# Altium schematic sheet WifiNode_Cpu0_R00.SchDoc: WifiNode_Cpu0_R00
size A4; Author: Sfara, Gonzalo Agustín; CompanyName: Introducción al Diseño de Circuitos Impresos; Organization: UTN FRBA; Revision: 00; SheetNumber: 3; SheetTotal: 5
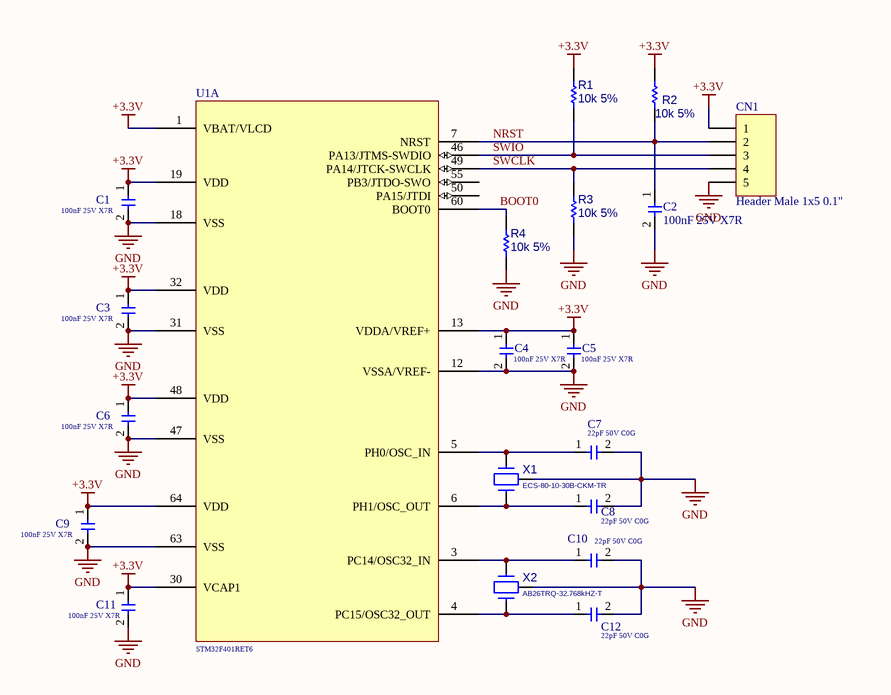
[diagram p0: WifiNode_Cpu0_R00.SchDoc]

## Parts
C1  100nF 25V X7R  [C_0805]
C2  100nF 25V X7R  [C_0805]
C3  100nF 25V X7R  [C_0805]
C4  100nF 25V X7R  [C_0805]
C5  100nF 25V X7R  [C_0805]
C6  100nF 25V X7R  [C_0805]
C7  22pF 50V C0G  [C_0805]
C8  22pF 50V C0G  [C_0805]
C9  100nF 25V X7R  [C_0805]
C10  22pF 50V C0G  [C_0805]
C11  100nF 25V X7R  [C_0805]
C12  22pF 50V C0G  [C_0805]
CN1  Header Male 1x5 0.1"  [Header_M_1x5_0.1"]
R1  10k 5%  [R_0805]
R2  10k 5%  [R_0805]
R3  10k 5%  [R_0805]
R4  10k 5%  [R_0805]
U1  STM32F401RET6  [LQFP_64]  (part A of 2)
X1  ECS-80-10-30B-CKM-TR  [ABM3C]
X2  AB26TRQ-32.768kHZ-T  [AB26TQF]

## Nets
+3.3V: C1.1 C3.1 C4.1 C5.1 C6.1 C9.1 C11.1 CN1.1 R1.2 R2.2 U1.1(VBAT/VLCD) U1.13(VDDA/VREF+) U1.19(VDD) U1.30(VCAP1) U1.32(VDD) U1.48(VDD) U1.64(VDD)
GND: C1.2 C2.2 C3.2 C4.2 C5.2 C6.2 C7.2 C8.2 C9.2 C10.2 C11.2 C12.2 CN1.5 R3.1 R4.1 U1.12(VSSA/VREF-) U1.18(VSS) U1.31(VSS) U1.47(VSS) U1.63(VSS) X1.3 X2.3
BOOT0: R4.2 U1.60(BOOT0)
NRST: C2.1 CN1.2 R2.1 U1.7(NRST)
SWCLK: CN1.4 R3.2 U1.49(PA14/JTCK-SWCLK)
SWIO: CN1.3 R1.1 U1.46(PA13/JTMS-SWDIO)
NetC7_1: C7.1 U1.5(PH0/OSC_IN) X1.2
NetC8_1: C8.1 U1.6(PH1/OSC_OUT) X1.1
NetC10_1: C10.1 U1.3(PC14/OSC32_IN) X2.2
NetC12_1: C12.1 U1.4(PC15/OSC32_OUT) X2.1

Not connected (* = marked no-connect by the designer): U1 50(PA15/JTDI) 55(PB3/JTDO-SWO)

## Notes on the sheet
- Title:
- Size:
- Author:
- A4
- Sheet
- of
- Revision:
- File:
- Date:

## Library data of the parts
C1-C12 = CAP_NP: Not polarized capacitor
CN1 = CONN_05P: Connector Generic 5 Vias
R1-R4 = Res1: Resistor
U1 = STM32F401RE
X1 X2 = CRYSTAL 3P: Crystal 2 Vias + GND